# Altium schematic sheet Sheet1.SchDoc
size A; SheetNumber: 1; SheetTotal: 2
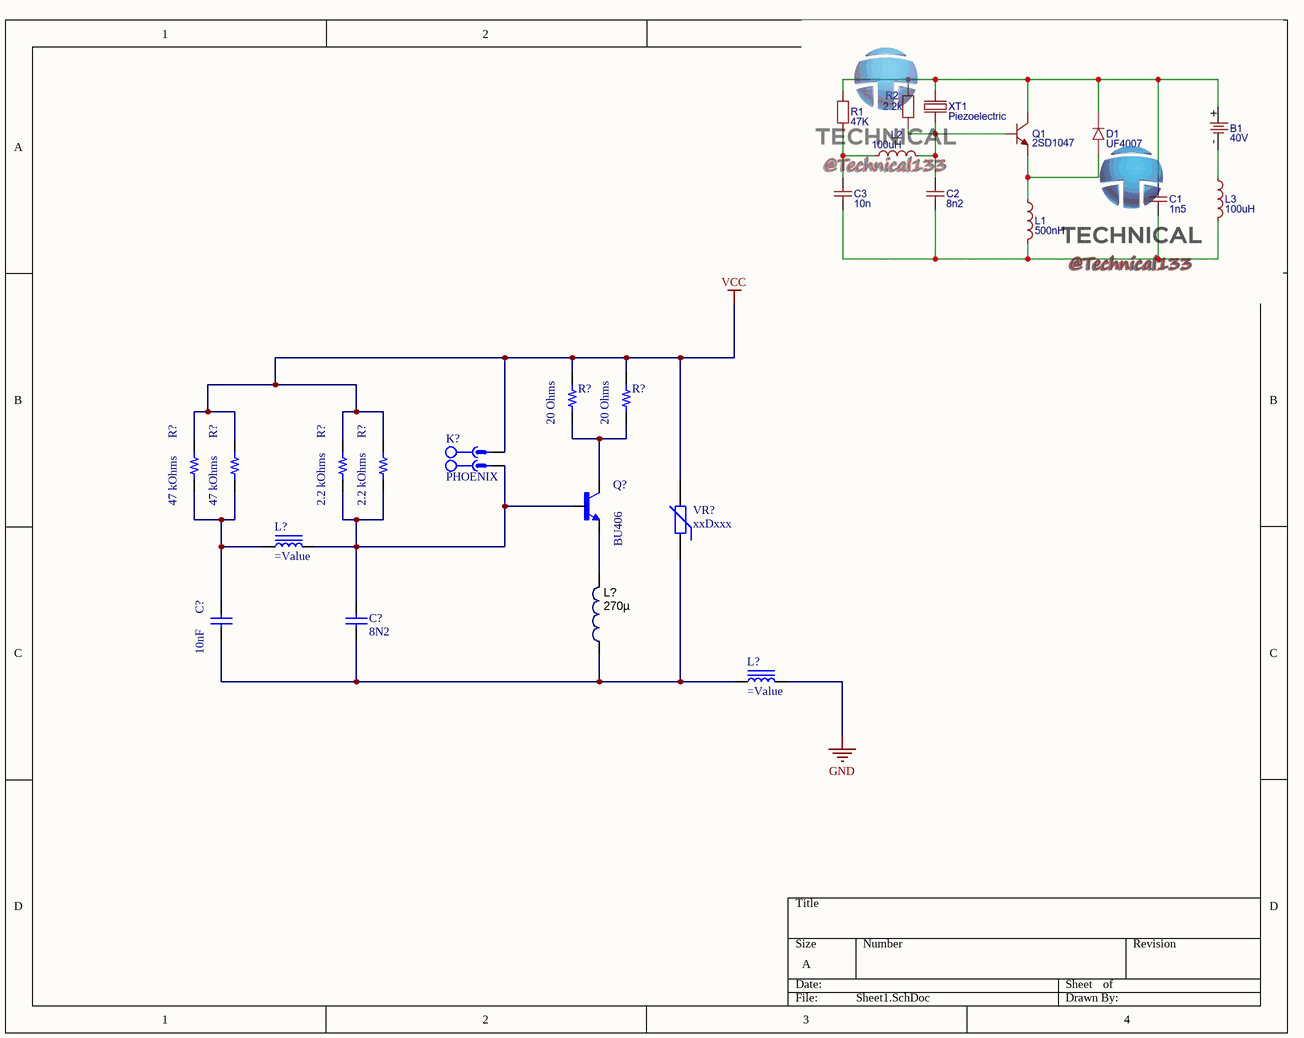
[diagram p0: Sheet1.SchDoc]

## Parts
(Parts that share a designator on the sheet are numbered #1, #2 ... from top to bottom, then left to right.)
C?#1  10nF  [Cap-100nF-400V]
C?#2  8N2  [Cap-220n-400V_Poly]
K?  PHOENIX  [KEY]
L?#1  (no value)  [BOURNS SRR1280]
L?#2  270µ  [Inductor 10x12 (200 mils)]
L?#3  (no value)  [BOURNS SRR1280]
Q?  BU406
R?#1  20 Ohms  [RES 2512_6432]
R?#2  20 Ohms  [RES 2512_6432]
R?#3  47 kOhms  [RES 1206_3216]
R?#4  47 kOhms  [RES 1206_3216]
R?#5  2.2 kOhms  [RES 1206_3216]
R?#6  2.2 kOhms  [RES 1206_3216]
VR?  xxDxxx  [07D XXX]

## Nets
GND: L?#3.2
VCC: K?.2 R?#1.2 R?#2.2 R?#3.2 R?#4.2 R?#5.2 R?#6.2 VR?.2
NetC?#1_1: C?#1.1 C?#2.1 L?#2.1 L?#3.1 VR?.1
NetC?#1_2: C?#1.2 L?#1.1 R?#3.1 R?#4.1
NetC?#2_2: C?#2.2 K?.1 L?#1.2 Q?.1(B) R?#5.1 R?#6.1
NetL?#2_2: L?#2.2 Q?.3(E)
NetQ?_2: Q?.2(C) R?#1.1 R?#2.1

## Library data of the parts
C?#1 C?#2 = CAP CERAMIC TOTAL SIZE: CAP Ceramic Total; Designer: Ali Hafizi
K? = KEY: 2 Pitch: 5.08 mm Color: green Contact surface: Tin Assembly; Manufacturer: PHOENIX CONTACT; Connector type: PCB Terminal Block; designer: ABBAS BASEREH; Max Current: 12 A; Positions: 2; Voltage: 320 V; Category: Connector; ComponentLink1Description: Header, Nominal current: 12 A Rated voltage (III/2): 320 V Number of positions: 2 Pitch: 5.08 mm Color: green Contact surface: Tin Assembly: Soldering  DESIGNER:ABBAS BASEREH; ComponentLink2Description: Reference; Mounting Technology: Through-Hole; Pin Count: 2; Revision 1: 2017-3-1; Status: Unreleased; PART.NO: PHOENIX
L?#1 L?#3 = SRR1280-680M: FIXED IND 68UH 2.4A 120 MOHM SMD; Part Number: SRR1280-680M
L?#2 = POWER INDUCTOR 10x12 (200 mils): Tolerance: ±20%; Type: Ferrite Core; SCDType: source; Package / Case: POWER INDUCTOR 10x12 (200 mils); Supplier 1: Digi-Key; Operating Temperature: -40°C ~ 125°C; Value: 270µ; PUBLISHER: ABBAS BASEREH  2017-3-1
Q? = NPN BJT: Bipolar (BJT) Transistor NPN 40 V 3 A 3MHz 2 W Through Hole TO-220; MF: ON Semiconductor; MP: TIP31G; SnapEDA_Link: https://www.snapeda.com/parts/TIP31G/Onsemi/view-part/?ref=snap; Availability: In Stock; Purchase-URL: https://pricing.snapeda.com/search/part/TIP31G/?ref=eda; Check_prices: https://www.snapeda.com/parts/TIP31G/Onsemi/view-part/?ref=eda; Value: *; Package: TO-220-3 ON Semiconductor; Price: None
R?#1 R?#2 = CRM2512-JW-200ELF: RES SMD 20 OHM 5% 2W 2512; Manufacturer: Bourns Inc.; Temperature Coefficient: ±200ppm/°C; Part Number: CRM2512-JW-200ELF; ComponentLink1Description: Datasheet; ComponentLink1URL: https://www.bourns.com/docs/Product-Datasheets/CRM.pdf; ComponentLink2Description: DigiKey Link; ComponentLink2URL: http://digikey.com/product-detail/en/bourns-inc/CRM2512-JW-200ELF/118-CRM2512-JW-200ELFCT-ND/10673821; Composition: Thick Film; Device Package: 2512 (6432 Metric); Features: Current Sense; Height - Seated (Max): 0.031" (0.80mm); LastUpdated: 9/2/2020 1:26:49 AM; Lifecycle Status: Active; Minimum Order: 1; Number of Terminations: 2; Operating Temperature: -55°C ~ 155°C; Package / Case: 2512 (6432 Metric); Packaging: TapeAndReel; Part Status: Active; Power (Watts): 2W; Price: 0.06; Resistance: 20 Ohms; Series: CRM2512; Size / Dimension: 0.248" L x 0.122" W (6.30mm x 3.10mm); Supplier 1: DigiKey; Supplier Part Number 1: 118-CRM2512-JW-200ELFCT-ND; Supplier Device Package: 2512; Tolerance: ±5%; Value: 20 Ohms
R?#3 R?#4 = ERA-8ARW473V: RES SMD 47K OHM 0.05% 1/4W 1206; Manufacturer: Panasonic Electronic Components; Power (Watts): 0.25W, 1/4W; Temperature Coefficient: ±10ppm/°C; Part Number: ERA-8ARW473V; ComponentLink1Description: Datasheet; ComponentLink1URL: https://industrial.panasonic.com/cdbs/www-data/pdf/RDM0000/AOA0000C307.pdf; ComponentLink2Description: DigiKey Link; ComponentLink2URL: http://digikey.com/product-detail/en/panasonic-electronic-components/ERA-8ARW473V/P47KCTCT-ND/5141480; Composition: Thin Film; Device Package: 1206 (3216 Metric); Features: Automotive AEC-Q200; Height - Seated (Max): 0.028" (0.70mm); LastUpdated: 1/30/2023 8:32:42 PM; Lifecycle Status: Active; Minimum Order: 1; Number of Terminations: 2; Operating Temperature: -55°C ~ 155°C; Package / Case: 1206 (3216 Metric); Packaging: TapeAndReel; PartId: 27491; Part Status: Active; Price: 0.57; Ratings: AEC-Q200; Resistance: 47 kOhms; Series: ERA-8A; Size / Dimension: 0.126" L x 0.063" W (3.20mm x 1.60mm); Supplier 1: DigiKey; Supplier Part Number 1: P47KCTCT-ND; Supplier Device Package: 1206; Tolerance: ±0.05%; Value: 47 kOhms
R?#5 R?#6 = RCS12062K20FKEA: RCS1206 100 2K2 1% ET1 E3; Manufacturer: Vishay Dale; Power (Watts): 0.5W, 1/2W; Temperature Coefficient: ±100ppm/°C; Part Number: RCS12062K20FKEA; ComponentLink1Description: Datasheet; ComponentLink1URL: http://www.vishay.com/docs/20065/rcse3.pdf; ComponentLink2Description: DigiKey Link; ComponentLink2URL: https://www.digikey.com/en/products/detail/vishay-dale/RCS12062K20FKEA/10059678; Composition: Thick Film; Device Package: 1206 (3216 Metric); Features: Automotive AEC-Q200, Pulse Withstanding; Height - Seated (Max): 0.026" (0.65mm); LastUpdated: 1/30/2023 8:31:41 PM; Lifecycle Status: Active; Minimum Order: 1; Number of Terminations: 2; Operating Temperature: -55°C ~ 155°C; Package / Case: 1206 (3216 Metric); Packaging: TapeAndReel; PartId: 40840; Part Status: Active; Price: 0.04; Ratings: AEC-Q200; Resistance: 2.2 kOhms; Series: RCS e3; Size / Dimension: 0.126" L x 0.063" W (3.20mm x 1.60mm); Supplier 1: DigiKey; Supplier Part Number 1: 541-10612-1-ND; Supplier Device Package: 1206; Tolerance: ±1%; Value: 2.2 kOhms
VR? = VARISTOR (VDR): VARISTORS; Manufacturer: china-canada-philipina; Designer: Abbas Basereh; Models: MOV-VDR-COV; Data: 2017-1-5; Link: digikey.com; VALUE: xxDxxx; PUBLISHER: ABBAS BASEREH